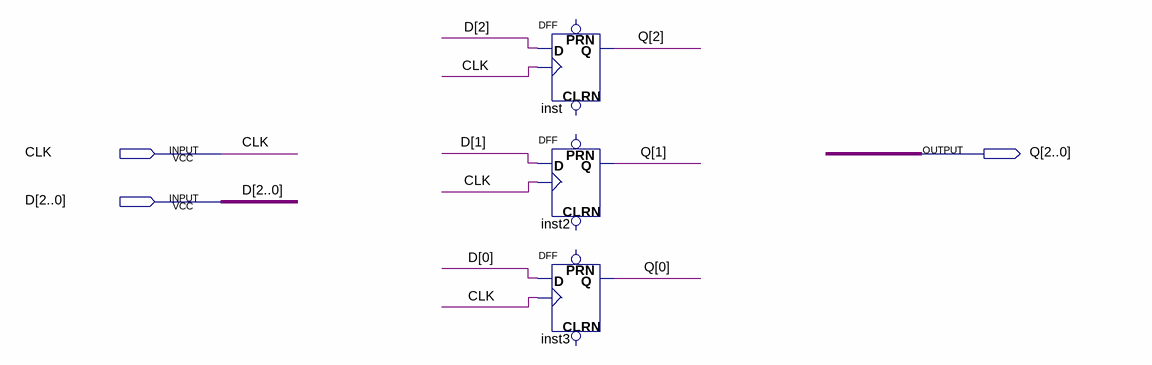
[diagram p0: schematic sheet]
// Quartus schematic PRESENT_STATE.bdf as structural Verilog: 3 symbols, 3 pins
module PRESENT_STATE (
  input  CLK,
  input  [2:0] D,
  output [2:0] Q
);

  DFF inst (.CLK(CLK), .D(D[2]), .Q(Q[2]));  // open: CLRN, PRN
  DFF inst2 (.CLK(CLK), .D(D[1]), .Q(Q[1]));  // open: CLRN, PRN
  DFF inst3 (.CLK(CLK), .D(D[0]), .Q(Q[0]));  // open: CLRN, PRN
endmodule
